# Altium project Klotz.PrjPCB
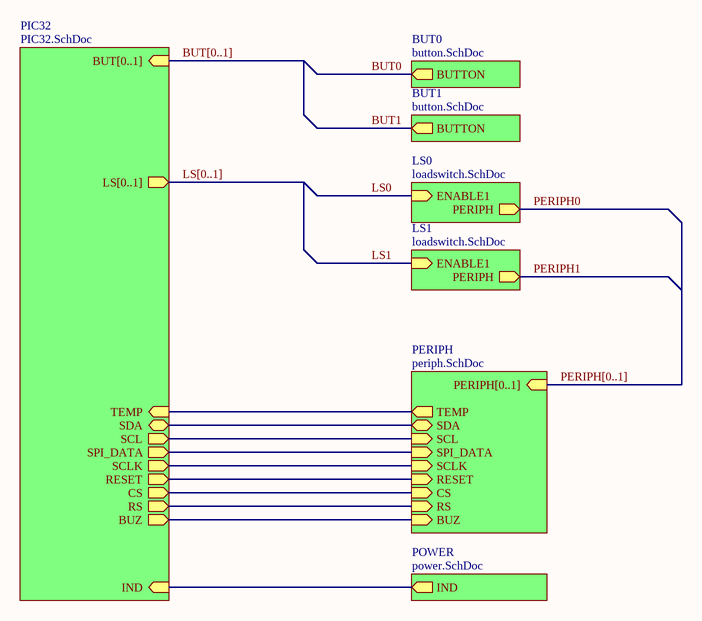
[diagram p0: Klotz.SchDoc]
6 sheets, 42 parts. Net scope: hierarchical (ports join the sheet entries above them; power ports are global).
Board file: Klotz.PcbDoc
Sheets:
  Klotz.SchDoc
    PIC32 = PIC32.SchDoc
    LS0 = loadswitch.SchDoc
    PERIPH = periph.SchDoc
    POWER = power.SchDoc
    LS1 = loadswitch.SchDoc
    BUT1 = button.SchDoc
    BUT0 = button.SchDoc

## Sheet Klotz.SchDoc
size A

### Sub-sheets
BUT0 = button.SchDoc: BUTTON (out)
BUT1 = button.SchDoc: BUTTON (out)
LS0 = loadswitch.SchDoc: ENABLE1 (in), PERIPH (out)
LS1 = loadswitch.SchDoc: ENABLE1 (in), PERIPH (out)
PERIPH = periph.SchDoc: PERIPH[0..1] (in), TEMP (out), SDA (bidir), SCL (in), SPI_DATA (in), SCLK (in), RESET (in), CS (in), BUZ (in), RS (in)
PIC32 = PIC32.SchDoc: BUT[0..1] (in), LS[0..1] (out), TEMP (in), SDA (bidir), SCL (out), SCLK (out), BUZ (out), SPI_DATA (out), RESET (out), CS (out), IND (in), RS (out)
POWER = power.SchDoc: IND (out)

### Nets
IND: sheet PIC32/IND, sheet POWER/IND
NetC1_2: sheet PIC32/TEMP, sheet PERIPH/TEMP
NetJ2_22: sheet PIC32/SPI_DATA, sheet PERIPH/SPI_DATA
NetJ2_24: sheet PIC32/SCLK, sheet PERIPH/SCLK
NetJ2_25: sheet PIC32/RESET, sheet PERIPH/RESET
NetJ2_26: sheet PIC32/CS, sheet PERIPH/CS
NetJ2_27: sheet PIC32/RS, sheet PERIPH/RS
NetJ3_1: sheet PIC32/BUZ, sheet PERIPH/BUZ
NetJ4_5: sheet PIC32/SCL, sheet PERIPH/SCL
NetJ4_6: sheet PIC32/SDA, sheet PERIPH/SDA

### Buses and harness runs
bus BUT[0..1] = sheet PIC32/BUT[0..1]
bus LS[0..1] = sheet PIC32/LS[0..1]
bus PERIPH[0..1] = sheet PERIPH/PERIPH[0..1]

## Sheet PIC32.SchDoc
size A
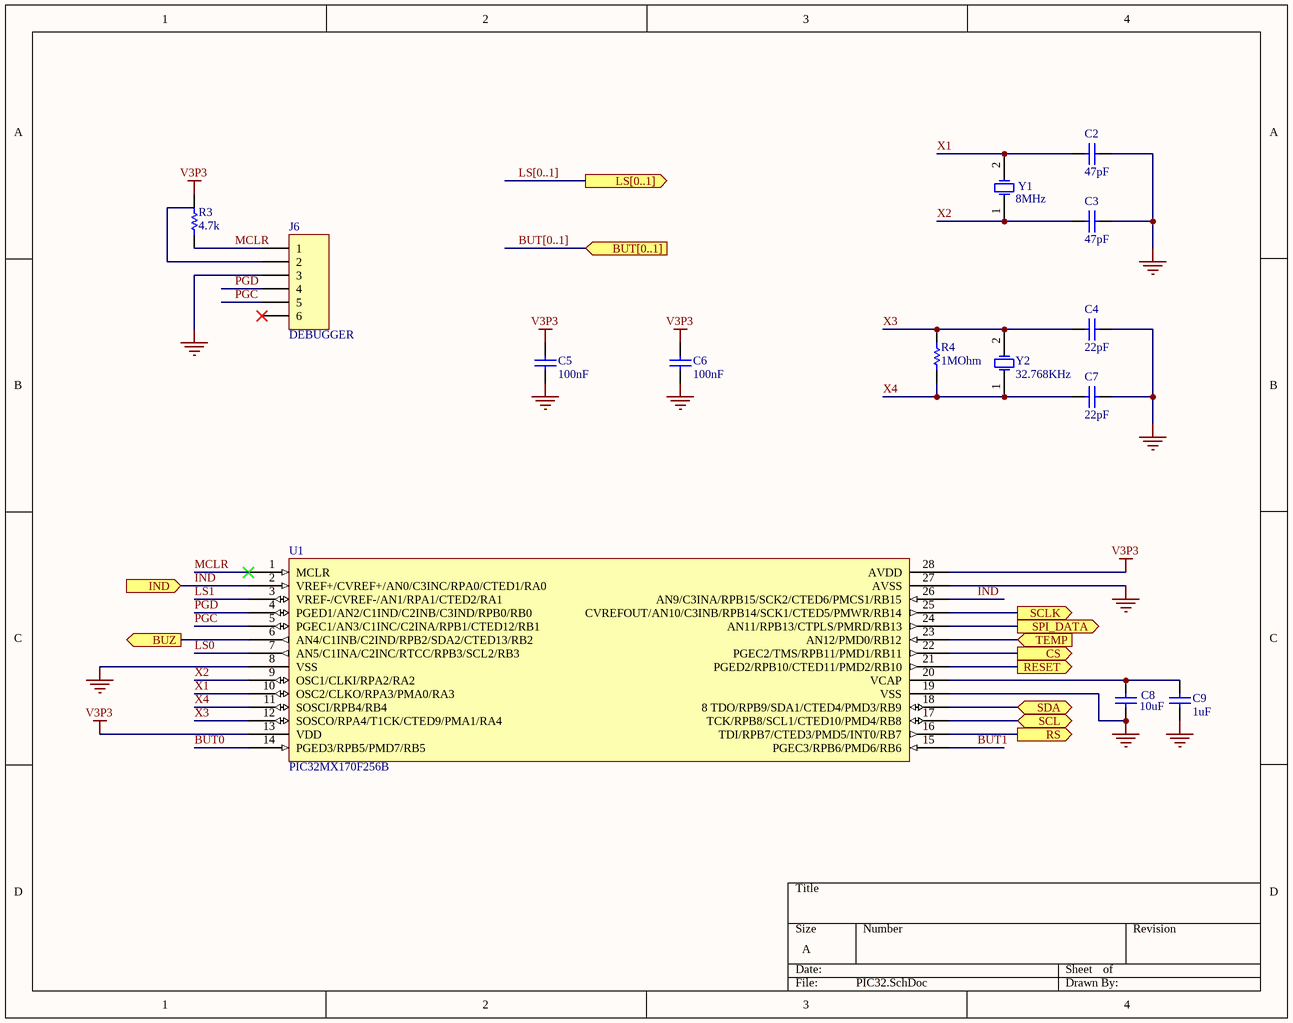
[diagram p1: PIC32.SchDoc]

### Parts
C2  47pF  [CAPACITOR]
C3  47pF  [CAPACITOR]
C4  22pF  [CAPACITOR]
C5  100nF  [CAPACITOR]
C6  100nF  [CAPACITOR]
C7  22pF  [CAPACITOR]
C8  10uF  [CAPACITOR]
C9  1uF  [CAPACITOR]
J6  DEBUGGER  [DEBUG]
R3  4.7k  [Resistor]
R4  1MOhm  [Resistor]
U1  PIC32MX170F256B  [PIC32]
Y1  8MHz  [OSC1]
Y2  32.768KHz  [OSC2]

### Ports
BUT[0..1] (in), BUZ (out), CS (out), IND (in), LS[0..1] (out), RESET (out), RS (out), SCL (bidir), SCLK (out), SDA (bidir), SPI_DATA (out), TEMP (in)

### Nets
GND: C2.2 C3.2 C4.2 C5.1 C6.1 C7.2 C8.1 C9.1 J6.3 U1.8(VSS) U1.19(VSS) U1.27(AVSS)
V3P3: C5.2 C6.2 R3.1 U1.13(VDD) U1.28(AVDD)
BUT0: U1.14(PGED3/RPB5/PMD7/RB5)
BUT1: U1.15(PGEC3/RPB6/PMD6/RB6)
IND: U1.2(VREF+/CVREF+/AN0/C3INC/RPA0/CTED1/RA0) U1.26(AN9/C3INA/RPB15/SCK2/CTED6/PMCS1/RB15) ; port IND
LS0: U1.7(AN5/C1INA/C2INC/RTCC/RPB3/SCL2/RB3)
LS1: U1.3(VREF-/CVREF-/AN1/RPA1/CTED2/RA1)
MCLR: J6.1 R3.2 U1.1(MCLR)
PGC: J6.5 U1.5(PGEC1/AN3/C1INC/C2INA/RPB1/CTED12/RB1)
PGD: J6.4 U1.4(PGED1/AN2/C1IND/C2INB/C3IND/RPB0/RB0)
X1: C2.1 U1.10(OSC2/CLKO/RPA3/PMA0/RA3) Y1.2(OSC2)
X2: C3.1 U1.9(OSC1/CLKI/RPA2/RA2) Y1.1(OSC1)
X3: C4.1 R4.1 U1.12(SOSCO/RPA4/T1CK/CTED9/PMA1/RA4) Y2.2(OSC2)
X4: C7.1 R4.2 U1.11(SOSCI/RPB4/RB4) Y2.1(OSC1)
NetC1_2: U1.23(AN12/PMD0/RB12) ; port TEMP
NetC8_2: C8.2 C9.2 U1.20(VCAP)
NetJ2_22: U1.24(AN11/RPB13/CTPLS/PMRD/RB13) ; port SPI_DATA
NetJ2_24: U1.25(CVREFOUT/AN10/C3INB/RPB14/SCK1/CTED5/PMWR/RB14) ; port SCLK
NetJ2_25: U1.21(PGED2/RPB10/CTED11/PMD2/RB10) ; port RESET
NetJ2_26: U1.22(PGEC2/TMS/RPB11/PMD1/RB11) ; port CS
NetJ2_27: U1.16(TDI/RPB7/CTED3/PMD5/INT0/RB7) ; port RS
NetJ3_1: U1.6(AN4/C1INB/C2IND/RPB2/SDA2/CTED13/RB2) ; port BUZ
NetJ4_5: U1.17(TCK/RPB8/SCL1/CTED10/PMD4/RB8) ; port SCL
NetJ4_6: U1.18(8_TDO/RPB9/SDA1/CTED4/PMD3/RB9) ; port SDA

Not connected (* = marked no-connect by the designer): J6 2 6*

### Buses and harness runs
bus BUT[0..1] = port BUT[0..1]
bus LS[0..1] = port LS[0..1]

### Library data of the parts
C2-C9 = Cap: Capacitor; Published: 8-Jun-2000; LatestRevisionDate: 17-Jul-2002; LatestRevisionNote: Re-released for DXP Platform.; PackageReference: RAD-0.3; Publisher: Altium Limited; PackageDescription: Radial Cap, Thru-Hole; 2 Leads; 0.3 in Pin Spacing
J6 = Header 6: DEB Connector; Ref. Fournisseur: 9731172; Fabricant: Molex; Fournisseur: Farnell; LatestRevisionDate: 17-Jul-2002; LatestRevisionNote: Re-released for DXP Platform.; Publisher: Altium Limited; Ref. Fabricant: 22-27-2061
R3 R4 = Res1: Resistor; Published: 8-Jun-2000; LatestRevisionDate: 17-Jul-2002; LatestRevisionNote: Re-released for DXP Platform.; PackageReference: AXIAL-0.3; Publisher: Altium Limited; PackageDescription: Axial Device, Thru-Hole; 2 Leads; 0.3 in Pin Spacing
  R3: Value: 4.7k
  R4: Value: 1MOhm
U1 = PIC32MX170F256B: PIC32; Fabricant: MICROCHIP; Ref. Fabricant: PIC32MX170F256B-I/SO; Fournisseur: Farnell; Ref. Fournisseur: 2449077
Y1 = XTAL: Crystal Oscillator; Fabricant: IQD FREQUENCY PRODUCTS; Fournisseur: Farnell; Ref. Fabricant: LFXTAL003156; Ref. Fournisseur: 9712844; Published: 8-Jun-2000; LatestRevisionDate: 17-Jul-2002; LatestRevisionNote: Re-released for DXP Platform.; PackageReference: R38; Publisher: Altium Limited; PackageDescription: Crystal, Thru-Hole; 2 Leads; Body 3.1 x 8.2 mm (Dia.xH)
Y2 = XTAL: Crystal Oscillator; Fabricant: RALTRON; Fournisseur: Farnell; Ref. Fabricant: R26-32.768- 12.5; Ref. Fournisseur: 1652573; Published: 8-Jun-2000; LatestRevisionDate: 17-Jul-2002; LatestRevisionNote: Re-released for DXP Platform.; PackageReference: R38; Publisher: Altium Limited; PackageDescription: Crystal, Thru-Hole; 2 Leads; Body 3.1 x 8.2 mm (Dia.xH)

## Sheet loadswitch.SchDoc
size A
Used 2 times, as channels LS0, LS1. Parts and nets are listed once, with the designators drawn on the sheet.
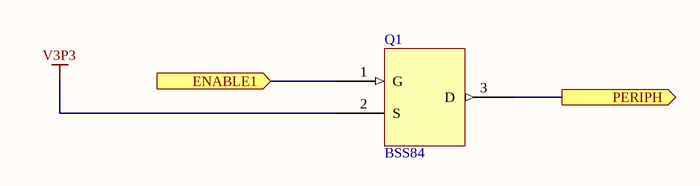
[diagram p2: loadswitch.SchDoc]

### Parts
Q1  BSS84  [TRANSISTOR]

### Ports
ENABLE1 (in), PERIPH (out)

### Nets
V3P3: Q1.2(S)
ENABLE1: Q1.1(G) ; port ENABLE1
PERIPH: Q1.3(D) ; port PERIPH

### Channels
LS0: designators end in _LS0; ports ENABLE1=LS0 PERIPH=PERIPH0
LS1: designators end in _LS1; ports ENABLE1=LS1 PERIPH=PERIPH1

### Library data of the parts
Q1 = BSS84: Transistor; Fabricant: DIODES INC.; Ref. Fabricant: BSS84-7-F; Fournisseur: Farnell; Ref. Fournisseur: 1843716

## Sheet periph.SchDoc
size A4
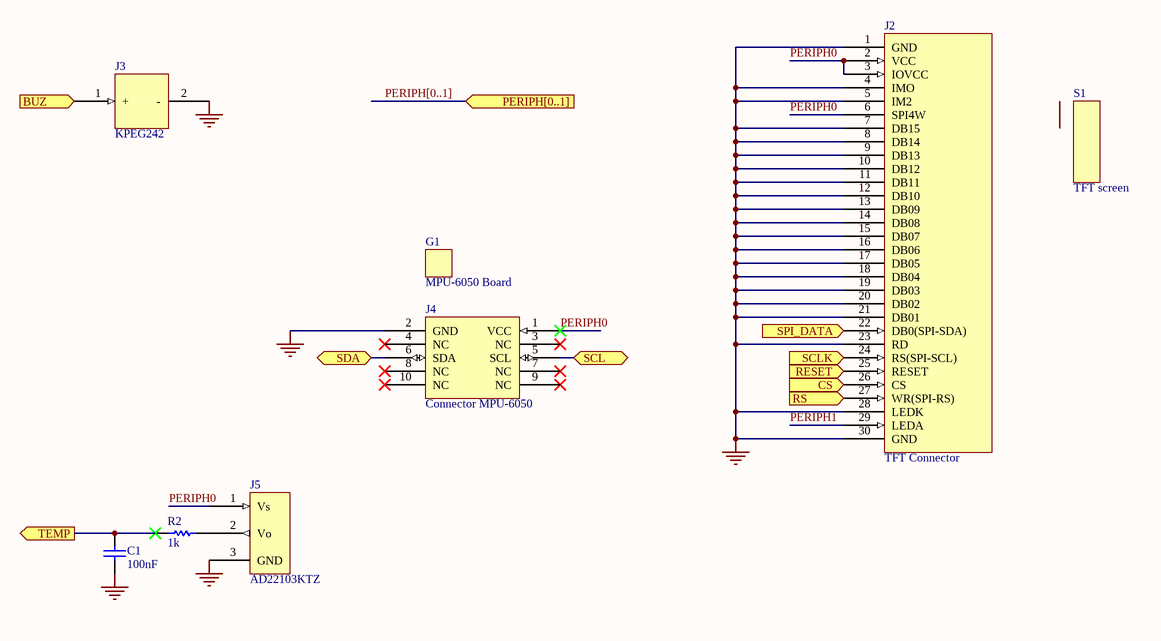
[diagram p3: periph.SchDoc]

### Parts
C1  100nF  [CAPACITOR]
G1  MPU-6050 Board  (mechanical)
J2  TFT Connector  [SCREEN]
J3  KPEG242  [BUZZER]
J4  Connector MPU-6050  [GYROSCOPE]
J5  AD22103KTZ  [TEMP]
R2  1k  [Resistor]
S1  TFT screen  (mechanical)

### Ports
BUZ (in), CS (in), PERIPH[0..1] (in), RESET (in), RS (in), SCL (bidir), SCLK (in), SDA (bidir), SPI_DATA (in), TEMP (out)

### Nets
GND: C1.1 J2.1(GND) J2.4(IMO) J2.5(IM2) J2.7(DB15) J2.8(DB14) J2.9(DB13) J2.10(DB12) J2.11(DB11) J2.12(DB10) J2.13(DB09) J2.14(DB08) J2.15(DB07) J2.16(DB06) J2.17(DB05) J2.18(DB04) J2.19(DB03) J2.20(DB02) J2.21(DB01) J2.23(RD) J2.28(LEDK) J2.30(GND) J3.2(-) J4.2(GND) J5.3(GND)
PERIPH0: J2.2(VCC) J2.3(IOVCC) J2.6(SPI4W) J4.1(VCC) J5.1(Vs)
PERIPH1: J2.29(LEDA)
NetC1_2: C1.2 R2.2 ; port TEMP
NetJ2_22: J2.22(DB0(SPI-SDA)) ; port SPI_DATA
NetJ2_24: J2.24(RS(SPI-SCL)) ; port SCLK
NetJ2_25: J2.25(RESET) ; port RESET
NetJ2_26: J2.26(CS) ; port CS
NetJ2_27: J2.27(WR(SPI-RS)) ; port RS
NetJ3_1: J3.1(+) ; port BUZ
NetJ4_5: J4.5(SCL) ; port SCL
NetJ4_6: J4.6(SDA) ; port SDA
NetJ5_2: J5.2(Vo) R2.1

Not connected (* = marked no-connect by the designer): J4 3(NC)* 4(NC)* 7(NC)* 8(NC)* 9(NC)* 10(NC)*

### Buses and harness runs
bus PERIPH[0..1] = port PERIPH[0..1]

### Library data of the parts
C1 = Cap: Capacitor; Published: 8-Jun-2000; LatestRevisionDate: 17-Jul-2002; LatestRevisionNote: Re-released for DXP Platform.; PackageReference: RAD-0.3; Publisher: Altium Limited; PackageDescription: Radial Cap, Thru-Hole; 2 Leads; 0.3 in Pin Spacing; Value: 100nF
G1 = MPU-6050: Fabricant: InvenSense; Fournisseur: Olimex; Ref. Fournisseur: MOD-MPU6050; Ref. Fabricant: MPU-6050
J2 = MCT0144C6W128128PML: Fabricant: OMRON ELECTRONIC COMPONENTS; Ref. Fabricant: XF2M30151A; Fournisseur: Farnell; Ref. Fournisseur: 1112560
J3 = KPEG242: Buzzer; Fabricant: KINGSTATE; Fournisseur: Farnell; Ref. Fournisseur: 1502726; Ref. Fabricant: KPEG242
J4 = Connector MPU-6050: Fabricant: WURTH ELEKTRONIK; Fournisseur: Farnell; Ref. Fabricant: 61301021021; Ref. Fournisseur: 1841231
J5 = AD22103KTZ: Temp sensor; Fabricant: Analog Devices; Fournisseur: Farnell; Ref. Fournisseur: 1438415; Ref. Fabricant: AD22103KTZ
R2 = Res1: Resistor; Published: 8-Jun-2000; LatestRevisionDate: 17-Jul-2002; LatestRevisionNote: Re-released for DXP Platform.; PackageReference: AXIAL-0.3; Publisher: Altium Limited; PackageDescription: Axial Device, Thru-Hole; 2 Leads; 0.3 in Pin Spacing; Value: 1k
S1 = Connector display: Fabricant: MIDAS; Fournisseur: Farnell; Ref. Fabricant: MCT0144C6W128128PML; Ref. Fournisseur: 2606862

## Sheet power.SchDoc
size A
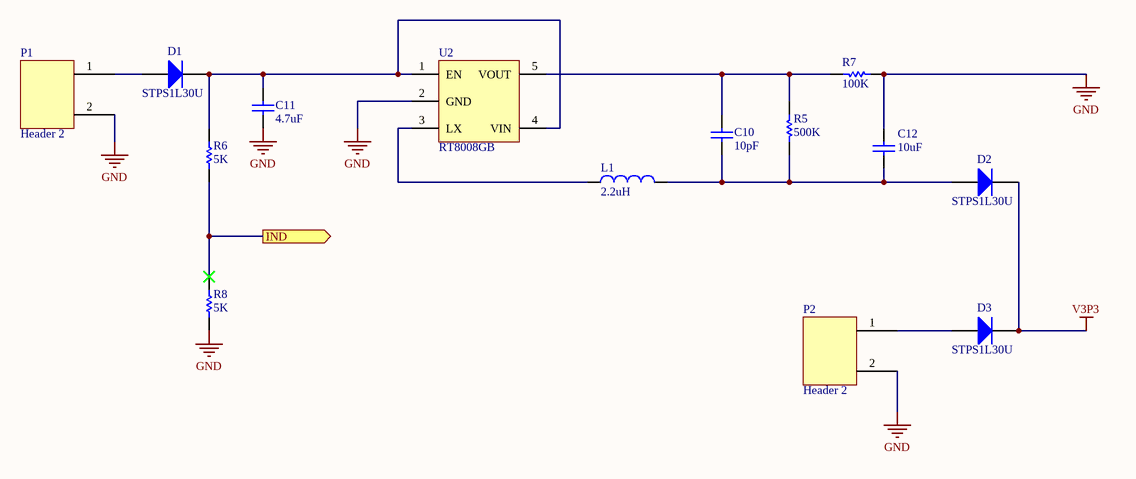
[diagram p4: power.SchDoc]

### Parts
C10  10pF  [CAPACITOR]
C11  4.7uF  [CAPACITOR]
C12  10uF  [CAPACITOR]
D1  STPS1L30U  [Schottky]
D2  STPS1L30U  [Schottky]
D3  STPS1L30U  [Schottky]
L1  2.2uH  [Inductor]
P1  Header 2  [Header 2 BATTERY]
P2  Header 2  [Header 2 BATTERY]
R5  500K  [Resistor]
R6  5K  [Resistor]
R7  100K  [Resistor]
R8  5K  [Resistor]
U2  RT8008GB  [REGULATEUR]

### Ports
IND (out)

### Nets
GND: C11.1 C12.1 P1.2 P2.2 R7.2 R8.1 U2.2(GND)
V3P3: D2.2(K) D3.2(K)
IND: R6.1 R8.2 ; port IND
NetC10_1: C10.1 R5.1 R7.1 U2.5(VOUT)
NetC10_2: C10.2 C12.2 D2.1(A) L1.2 R5.2
NetC11_2: C11.2 D1.2(K) R6.2 U2.1(EN) U2.4(VIN)
NetD1_1: D1.1(A) P1.1
NetD3_1: D3.1(A) P2.1
NetL1_1: L1.1 U2.3(LX)

### Library data of the parts
C10-C12 = Cap: Capacitor; Published: 8-Jun-2000; LatestRevisionDate: 17-Jul-2002; LatestRevisionNote: Re-released for DXP Platform.; PackageReference: RAD-0.3; Publisher: Altium Limited; PackageDescription: Radial Cap, Thru-Hole; 2 Leads; 0.3 in Pin Spacing
  C10: Value: 10pF
  C11: Value: 4.7uF
  C12: Value: 10uF
D1 = Diode: Diode Schottky; Fournisseur: Farnell; Fabricant: STMICROELECTRONICS; Ref. Fournisseur: 1467550; Published: 8-Jun-2000; LatestRevisionDate: 17-Jul-2002; LatestRevisionNote: Re-released for DXP Platform.; PackageVersion: Sep-1996; PackageReference: SMC; Publisher: Altium Limited; PackageDescription: DO-214-AB/SMC; 2 C-Bend Leads; Body 7.9 x 5.9 mm, inc. leads (LxW); Code_JEDEC: DO-214-AB; Ref. Fabricant: STPS1L30U
D2 D3 = Diode: Diode Schottky; Fabricant: STMICROELECTRONICS; Fournisseur: Farnell; Ref. Fournisseur: 1467550; Published: 8-Jun-2000; LatestRevisionDate: 17-Jul-2002; LatestRevisionNote: Re-released for DXP Platform.; PackageVersion: Sep-1996; PackageReference: SMC; Publisher: Altium Limited; PackageDescription: DO-214-AB/SMC; 2 C-Bend Leads; Body 7.9 x 5.9 mm, inc. leads (LxW); Code_JEDEC: DO-214-AB; Ref. Fabricant: STPS1L30U
L1 = Inductor: Code_IEC: 1005; Fabricant: WURTH ELEKTRONIK; Fournisseur: Farnell; Ref. Fabricant: 744772022; Ref. Fournisseur: 2211697; Published: 8-Jun-2000; LatestRevisionDate: 29-May-2009; LatestRevisionNote: IPC-7351 Footprint Added.; PackageReference: 0402-A; Publisher: Altium Limited; PackageDescription: Chip Inductor; Code_JEITA: 0402
P1 P2 = Header 2: Fabricant: MULTICOMP; Ref. Fabricant: 2211S-02G; Fournisseur: Farnell; Ref. Fournisseur: 1593411
R5-R8 = Res1: Resistor; Published: 8-Jun-2000; LatestRevisionDate: 17-Jul-2002; LatestRevisionNote: Re-released for DXP Platform.; PackageReference: AXIAL-0.3; Publisher: Altium Limited; PackageDescription: Axial Device, Thru-Hole; 2 Leads; 0.3 in Pin Spacing
U2 = RT8008GB: Voltage Regulator; Fabricant: RICHTEK; Fournisseur: Farnell; Ref. Fournisseur: 2362964; Ref. Fabricant: RT8008GB

## Sheet button.SchDoc
size A
Used 2 times, as channels BUT1, BUT0. Parts and nets are listed once, with the designators drawn on the sheet.
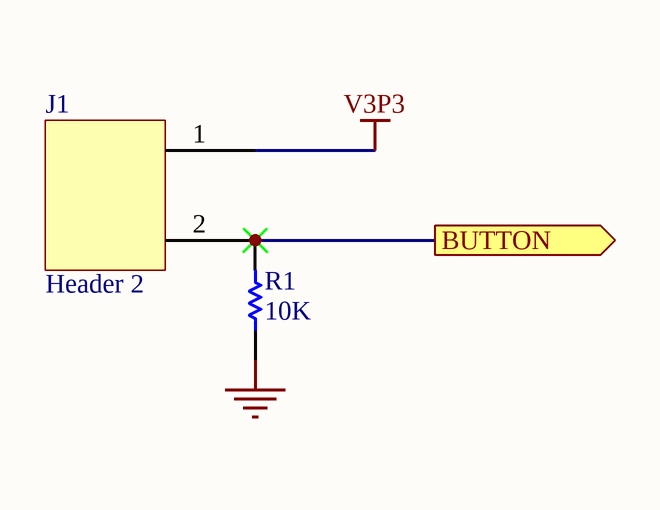
[diagram p5: button.SchDoc]

### Parts
J1  Header 2  [Header 2 BUTTON]
R1  10K  [Resistor]

### Ports
BUTTON (out)

### Nets
GND: R1.1
V3P3: J1.1
BUTTON: J1.2 R1.2 ; port BUTTON

### Channels
BUT1: designators end in _BUT1; ports BUTTON=BUT1
BUT0: designators end in _BUT0; ports BUTTON=BUT0

### Library data of the parts
J1 = Header 2: as P1 on sheet power
R1 = Res1: Resistor; Published: 8-Jun-2000; LatestRevisionDate: 17-Jul-2002; LatestRevisionNote: Re-released for DXP Platform.; PackageReference: AXIAL-0.3; Publisher: Altium Limited; PackageDescription: Axial Device, Thru-Hole; 2 Leads; 0.3 in Pin Spacing; Value: 10K

## Nets that join several sheets
GND: PIC32 (12 pins), periph (25 pins), power (7 pins), BUT1 (R1_BUT1.1), BUT0 (R1_BUT0.1)
V3P3: PIC32 (5 pins), LS0 (Q1_LS0.2), power (D2.2 D3.2), LS1 (Q1_LS1.2), BUT1 (J1_BUT1.1), BUT0 (J1_BUT0.1)
BUT0: PIC32 (U1.14), BUT0 (J1_BUT0.2 R1_BUT0.2)
BUT1: PIC32 (U1.15), BUT1 (J1_BUT1.2 R1_BUT1.2)
IND: PIC32 (U1.2 U1.26), power (R6.1 R8.2)
LS0: PIC32 (U1.7), LS0 (Q1_LS0.1)
LS1: PIC32 (U1.3), LS1 (Q1_LS1.1)
NetC1_2: PIC32 (U1.23), periph (C1.2 R2.2)
NetJ2_22: PIC32 (U1.24), periph (J2.22)
NetJ2_24: PIC32 (U1.25), periph (J2.24)
NetJ2_25: PIC32 (U1.21), periph (J2.25)
NetJ2_26: PIC32 (U1.22), periph (J2.26)
NetJ2_27: PIC32 (U1.16), periph (J2.27)
NetJ3_1: PIC32 (U1.6), periph (J3.1)
NetJ4_5: PIC32 (U1.17), periph (J4.5)
NetJ4_6: PIC32 (U1.18), periph (J4.6)
PERIPH0: LS0 (Q1_LS0.3), periph (5 pins)
PERIPH1: periph (J2.29), LS1 (Q1_LS1.3)